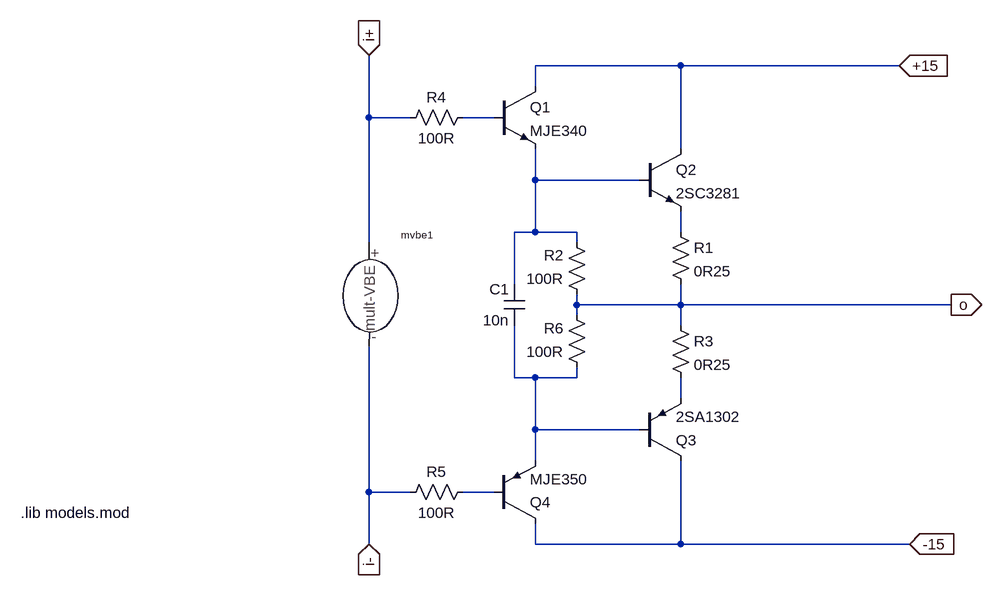
[diagram p0: schematic ss-inner-out.asc]
ss-inner-out.asc, the LTspice schematic file:
Version 4
SHEET 1 880 680
WIRE -96 -464 -320 -464
WIRE 0 -464 -96 -464
WIRE 240 -464 0 -464
WIRE -320 -432 -320 -464
WIRE -576 -384 -576 -480
WIRE -512 -384 -576 -384
WIRE -384 -384 -432 -384
WIRE -96 -336 -96 -464
WIRE -320 -288 -320 -336
WIRE -160 -288 -320 -288
WIRE -320 -208 -320 -288
WIRE -320 -208 -352 -208
WIRE -256 -208 -320 -208
WIRE -96 -208 -96 -240
WIRE -576 -192 -576 -384
WIRE -256 -192 -256 -208
WIRE -352 -128 -352 -208
WIRE -256 -96 -256 -112
WIRE -96 -96 -96 -128
WIRE -96 -96 -256 -96
WIRE 0 -96 -96 -96
WIRE 320 -96 0 -96
WIRE -256 -80 -256 -96
WIRE -96 -64 -96 -96
WIRE -352 16 -352 -64
WIRE -320 16 -352 16
WIRE -256 16 -256 0
WIRE -256 16 -320 16
WIRE -96 48 -96 16
WIRE -576 64 -576 -32
WIRE -320 96 -320 16
WIRE -160 96 -320 96
WIRE -320 144 -320 96
WIRE -576 192 -576 64
WIRE -512 192 -576 192
WIRE -384 192 -432 192
WIRE -576 272 -576 192
WIRE -320 272 -320 240
WIRE -176 272 -320 272
WIRE -96 272 -96 144
WIRE -96 272 -176 272
WIRE 256 272 -96 272
FLAG 256 272 -15
IOPIN 256 272 In
FLAG 240 -464 +15
IOPIN 240 -464 In
FLAG 320 -96 o
IOPIN 320 -96 Out
FLAG -576 272 i-
IOPIN -576 272 In
FLAG -576 -480 i+
IOPIN -576 -480 In
DATAFLAG -576 192 "round($*100)/100"
DATAFLAG -576 -384 "round($*100)/100"
DATAFLAG 0 -96 "round($*10k)/10k"
DATAFLAG -320 -288 "round($*1k)/1k"
DATAFLAG -320 96 "round($*1k)/1k"
DATAFLAG -176 272 "round($*100)/100"
DATAFLAG -576 64 "round(Ix(ampli:mvbe:+MVBE)*10k)/10k"
DATAFLAG 0 -464 "round($*100)/100"
DATAFLAG 0 -464 "round($*100)/100"
SYMBOL npn -384 -432 R0
SYMATTR InstName Q1
SYMATTR Value MJE340
SYMBOL npn -160 -336 R0
SYMATTR InstName Q2
SYMATTR Value 2SC3281
SYMBOL res -112 -224 R0
SYMATTR InstName R1
SYMATTR Value 0R25
SYMBOL res -240 -96 R180
WINDOW 0 36 76 Left 2
WINDOW 3 36 40 Left 2
SYMATTR InstName R2
SYMATTR Value 100R
SYMBOL res -112 -80 R0
SYMATTR InstName R3
SYMATTR Value 0R25
SYMBOL pnp -160 144 M180
SYMATTR InstName Q3
SYMATTR Value 2SA1302
SYMBOL pnp -384 240 M180
SYMATTR InstName Q4
SYMATTR Value MJE350
SYMBOL res -416 -400 R90
WINDOW 0 0 56 VBottom 2
WINDOW 3 32 56 VTop 2
SYMATTR InstName R4
SYMATTR Value 100R
SYMBOL res -416 176 R90
WINDOW 0 0 56 VBottom 2
WINDOW 3 32 56 VTop 2
SYMATTR InstName R5
SYMATTR Value 100R
SYMBOL res -240 16 R180
WINDOW 0 36 76 Left 2
WINDOW 3 36 40 Left 2
SYMATTR InstName R6
SYMATTR Value 100R
SYMBOL cap -336 -64 R180
WINDOW 0 24 56 Left 2
WINDOW 3 24 8 Left 2
SYMATTR InstName C1
SYMATTR Value 10n
SYMBOL ss-mult-vbe -576 -128 R0
SYMATTR InstName mvbe1
TEXT -1112 224 Left 2 !.lib models.mod

The netlist it stands for:
* ss-inner-out.asc
Q1 +15 N001 N002 0 MJE340
Q2 +15 N002 N003 0 2SC3281
R1 N003 o 0R25
R2 o N002 100R
R3 o N005 0R25
Q3 -15 N004 N005 0 2SA1302
Q4 -15 N006 N004 0 MJE350
R4 N001 i+ 100R
R5 N006 i- 100R
R6 N004 o 100R
C1 N004 N002 10n
Xmvbe1 i+ i- ss-mult-vbe  ; pins +mvbe -mvbe
.model NPN NPN
.model PNP PNP
.lib standard.bjt
.lib models.mod
.backanno
.end